# EAGLE design HS5035HD_Test_841 (EAGLE 7.4.0)
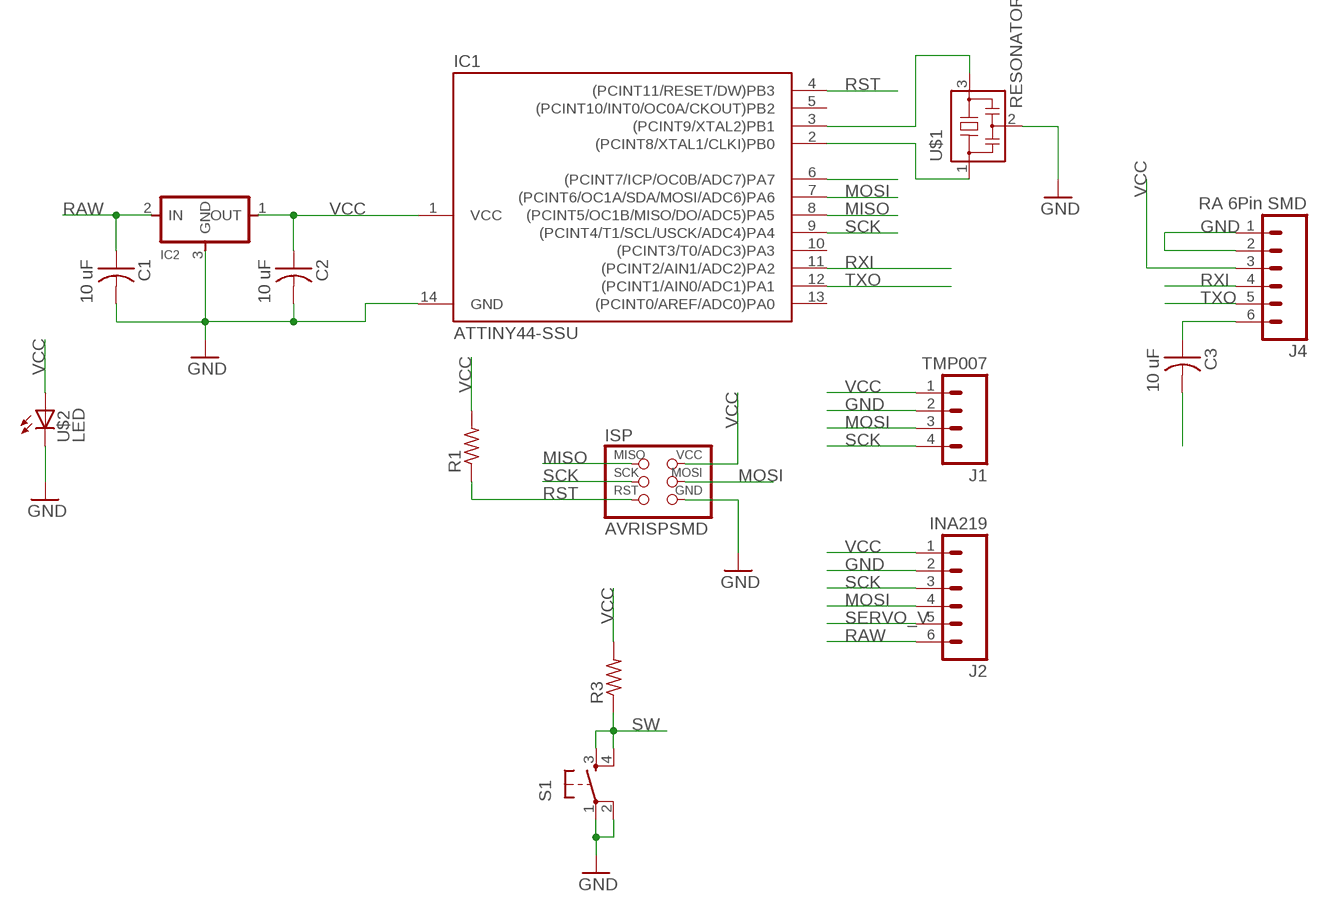
[diagram p0: schematic, sheet 1]

## Parts
C1  10 uF  CAP-US1206FAB  [C1206FAB]
C2  10 uF  CAP-US1206FAB  [C1206FAB]
C3  10 uF  CAP-US1206FAB  [C1206FAB]
IC1  ATTINY44-SSU  [SOIC14]
IC2  REGULATORSOT23  [SOT23]
ISP  AVRISPSMD  [2X03SMD]
J1  TMP007  M04SMD  [1X04-SMD]
J2  INA219  M06SMD  [1X06-SMD]
J4  RA 6Pin SMD  M06SMD  [1X06-SMD]
R1  RES-US1206FAB  [R1206FAB]
R3  RES-US1206FAB  [R1206FAB]
S1  6MM_SWITCH6MM_SWITCH  [6MM_SWITCH]
U$1  RESONATOR  [EFOBM]
U$2  LED  [LED1206]

## Nets
GND: C1.2 C2.2 IC1.14(GND) IC2.3(GND) ISP.6(GND) J1.2 J2.2 J4.1 J4.2 S1.1(P) S1.2(P1) U$1.2 U$2.2(C)
MISO: IC1.8((PCINT5/OC1B/MISO/DO/ADC5)PA5) ISP.1(MISO)
MOSI: IC1.7((PCINT6/OC1A/SDA/MOSI/ADC6)PA6) ISP.4(MOSI) J1.3 J2.4
N$2: IC1.3((PCINT9/XTAL2)PB1) U$1.3
N$3: IC1.2((PCINT8/XTAL1/CLKI)PB0) U$1.1
N$13: C3.1 J4.6
RAW: C1.1 IC2.2(IN) J2.6
RST: C3.2 IC1.4((PCINT11/RESET/DW)PB3) ISP.5(RST) R1.1
RXI: IC1.11((PCINT2/AIN1/ADC2)PA2) J4.4
SCK: IC1.9((PCINT4/T1/SCL/USCK/ADC4)PA4) ISP.3(SCK) J1.4 J2.3
SERVO_V: J2.5
SW: IC1.6((PCINT7/ICP/OC0B/ADC7)PA7) R3.1 S1.3(S) S1.4(S1)
TXO: IC1.12((PCINT1/AIN0/ADC1)PA1) J4.5
VCC: C2.1 IC1.1(VCC) IC2.1(OUT) ISP.2(VCC) J1.1 J2.1 J4.3 R1.2 R3.2 U$2.1(A)
Unconnected: IC1.5((PCINT10/INT0/OC0A/CKOUT)PB2) IC1.10((PCINT3/T0/ADC3)PA3) IC1.13((PCINT0/AREF/ADC0)PA0)

## Library data of the parts
C1-C3 = fab:CAP-US
IC1 = fab:ATTINY44
IC2 = fab:REGULATOR
ISP = fab:AVRISP
J1 = SparkFun-Connectors:M04: Header 4 Standard 4-pin 0.1" header. Use with straight break away headers (SKU : PRT-00116), right angle break away headers (PRT-00553), swiss pins (PRT-00743), machine pins (PRT-00117), and female headers (PRT-00115). Molex polarized connector foot print use with SKU : PRT-08231 with associated crimp pins and housings. 1MM SMD Version SKU: PRT-10208
J2 = SparkFun-Connectors:M06: Header 6 Standard 6-pin 0.1" header. Use with straight break away headers (SKU : PRT-00116), right angle break away headers (PRT-00553), swiss pins (PRT-00743), machine pins (PRT-00117), and female headers (PRT-00115). Molex polarized connector foot print use with SKU : PRT-08094 with associated crimp pins and housings. NOTES ON THE VARIANTS LOCK and LOCK_LONGPADS... This footprint was designed to help hold the alignment of a through-hole component (i.e. 6-pin header) while soldering it into place. You may notice that each hole has been shifted either up or down by 0.005 of an inch from it's more standard position (which is a perfectly straight line). This slight alteration caused the pins (the squares in the middle) to touch the edges of the holes. Because they are alternating, it causes a "brace" to hold the component in place. 0.005 has proven to be the perfect amount of "off-center" position when using our standard breakaway headers. Although looks a little odd when you look at the bare footprint, once you have a header in there, the alteration is very hard to notice. Also,if you push a header all the way into place, it is covered up entirely on the bottom side. This idea of altering the position of holes to aid alignment will be further integrated into the Sparkfun Library for other footprints. It can help hold any component with 3 or more connection pins.; PROD_ID: CONN-08971; VALUE: RA 6Pin SMD
J4 = SparkFun-Connectors:M06: Header 6 Standard 6-pin 0.1" header. Use with straight break away headers (SKU : PRT-00116), right angle break away headers (PRT-00553), swiss pins (PRT-00743), machine pins (PRT-00117), and female headers (PRT-00115). Molex polarized connector foot print use with SKU : PRT-08094 with associated crimp pins and housings. NOTES ON THE VARIANTS LOCK and LOCK_LONGPADS... This footprint was designed to help hold the alignment of a through-hole component (i.e. 6-pin header) while soldering it into place. You may notice that each hole has been shifted either up or down by 0.005 of an inch from it's more standard position (which is a perfectly straight line). This slight alteration caused the pins (the squares in the middle) to touch the edges of the holes. Because they are alternating, it causes a "brace" to hold the component in place. 0.005 has proven to be the perfect amount of "off-center" position when using our standard breakaway headers. Although looks a little odd when you look at the bare footprint, once you have a header in there, the alteration is very hard to notice. Also,if you push a header all the way into place, it is covered up entirely on the bottom side. This idea of altering the position of holes to aid alignment will be further integrated into the Sparkfun Library for other footprints. It can help hold any component with 3 or more connection pins.; PROD_ID: CONN-08971
R1 R3 = fab:RES-US: Resistor (US Symbol) Variants with postfix FAB are widened to allow the routing of internal traces
S1 = fab:6MM_SWITCH: OMRON SWITCH
U$1 = fab:RESONATOR
U$2 = fab:LED: LED

## Board
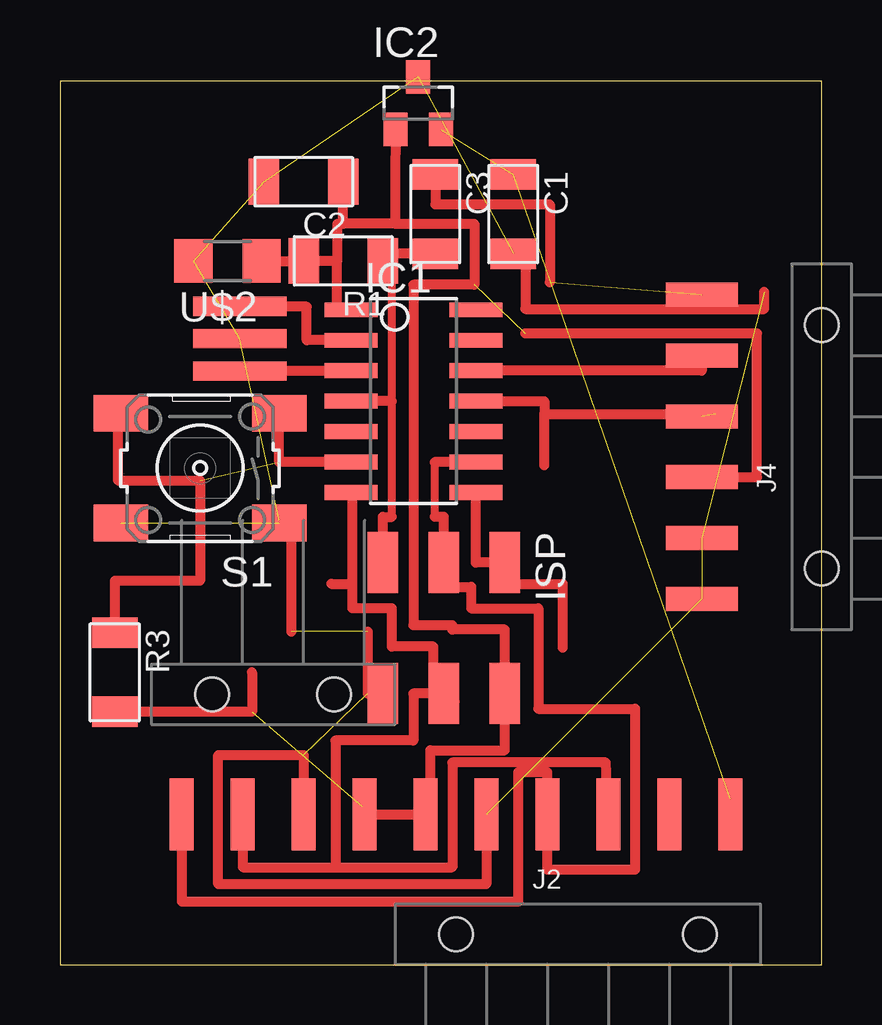
[diagram p1: board, top side]

Size 31.75 x 36.83 mm. Coordinates in mm from the lower left corner, seen from the top.
Outline: 0,0 31.75,0 31.75,36.83 0,36.83 0,0
Copper layers (1*16): Top 0.035mm / dielectric 1.5mm / Bottom 0.035mm
Design rules "default *": minimum track width 10mil, minimum drill 24mil, track to track 16mil, track to pad 16mil, pad to pad 16mil, via to via 16mil, smd to smd 4mil, copper to edge 16mil, drill to drill 8mil, minimum pad ring 10mil, minimum via ring 8mil, stop-mask expansion 4mil, vias tented up to drill 0mil, thermal gap 0mil

### Footprints (pad centres in the part's own frame; a part is rotated, then mirrored left to right if it is on the bottom)
C1206FAB = smd 1.27 x 1.905: 1 -1.651,0; 2 1.651,0
SOIC14 = smd 0.61 x 2.21: 1 -3.81,-2.603; 2 -2.54,-2.603; 3 -1.27,-2.603; 4 0,-2.603; 5 1.27,-2.603; 6 2.54,-2.603; 7 3.81,-2.603; 8 3.81,2.603; 9 2.54,2.603; 10 1.27,2.603; 11 0,2.603; 12 -1.27,2.603; 13 -2.54,2.603; 14 -3.81,2.603
SOT23 = smd 1 x 1.4: 1 -0.95,-1.1; 2 0.95,-1.1; 3 0,1.1
2X03SMD = smd 2.54 x 1.27: 1 -2.54,2.54; 2 2.92,2.54; 3 -2.54,0; 4 2.92,0; 5 -2.54,-2.54; 6 2.92,-2.54
1X04-SMD = smd 1 x 3: 1 -3.81,5; 2 -1.27,5; 3 1.27,5; 4 3.81,5 | hole 1.4: -2.54,0; 2.54,0
1X06-SMD = smd 1 x 3: 1 -6.35,5; 2 -3.81,5; 3 -1.27,5; 4 1.27,5; 5 3.81,5; 6 6.35,5 | hole 1.4: -5.08,0; 5.08,0
R1206FAB = smd 1.27 x 1.905: 1 -1.651,0; 2 1.651,0
6MM_SWITCH = smd 2.286 x 1.524: 1 -3.302,2.286; 2 3.302,2.286; 3 -3.302,-2.286; 4 3.302,-2.286
EFOBM = smd 0.8 x 3.9: 1 -1.35,0; 2 0,0; 3 1.35,0
LED1206 = smd 1.6 x 1.803: 1 -1.422,0; 2 1.422,0

### Placement (x,y rotation side)
C1  18.9,31.29 270 top
C2  10.16,32.64 180 top
C3  15.65,31.29 270 top
IC1  14.73,23.5 270 top
IC2  14.94,35.92 0 top
ISP  16,14.22 270 top
J1  8.89,11.28 180 top
J2  21.59,1.27 0 top
J4  31.75,21.59 90 top
R1  11.81,29.34 180 top
R3  2.29,12.19 270 top
S1  5.84,20.7 180 top
U$1  7.49,26.1 270 top
U$2  6.99,29.34 180 top

### Tracks (layer width: path | path; a pad name or v marks a point on that pad's centre or on a via)
GND  (11 unrouted)
  Top 0.406: 9.65,13.89 9.65,18.54 9.14,18.54 S1.1 | 12.83,13.89 12.83,11.3 ISP.6 | J2.2 17.78,3.35 6.6,3.35 6.6,8.74 10.16,8.74 J1.2 | C1.2 19.41,29.64 19.41,27.33 29.36,27.33 29.36,28.04
  Top 1.016: ISP.6
MISO
  Top 0.406: IC1.8 17.34,16.76 ISP.1 18.54,15.88 20.95,15.88 20.95,13.21
MOSI
  Top 0.406: ISP.4 16,12.37 15.57,12.37 15.57,13.26 13.84,13.26 13.84,14.86 12.19,14.86 12.19,15.88 | 12.19,15.88 12.19,19.68 IC1.7 | 11.3,15.88 12.19,15.88 | ISP.4 14.73,11.3 14.73,9.35 11.48,9.35 11.48,4.06 | J2.4 22.76,8.43 16.36,8.43 16.36,4.06 11.48,4.06 | 16.46,10.97 16,10.97 ISP.4 | J1.3 7.62,4.06 11.48,4.06
N$2
  Top 0.406: IC1.3 12.13,24.75 U$1.3
N$3
  Top 0.406: IC1.2 10.29,26.04 10.29,27.43 6.6,27.43 6.6,27.3 7.62,27.3 U$1.1
N$13  (1 unrouted)
  Top 0.406: C3.1 15.65,31.7 20.42,31.7 20.42,28.45
RAW  (2 unrouted)
  Top 0.406: J2.6 27.94,6.91 28.14,6.91
RST
  Top 0.33: 13.84,18.67 13.84,23.5 13.84,29.08 R1.1
  Top 0.406: ISP.5 13.46,18.67 13.84,18.67 | 13.84,23.5 IC1.4 | C3.2 13.46,29.64 R1.1
RXI  (1 unrouted)
  Top 0.406: IC1.11 20.19,23.5 20.19,22.96 | 20.19,20.83 20.19,22.96 | 20.19,22.96 27.33,22.96
SCK
  Top 0.33: 15.62,20.95 15.62,18.67
  Top 0.406: IC1.9 15.62,20.95 | 15.62,18.67 16,18.67 ISP.3 16,15.75 17.14,15.75 17.14,14.86 19.94,14.86 19.94,10.67 23.98,10.67 23.98,3.96 20.32,3.96 J2.3 20.32,8.03 19.1,8.03 19.1,2.64 5.08,2.64 J1.4
SW  (1 unrouted)
  Top 0.406: IC1.6 9.14,20.95 S1.3 | R3.1 2.29,16 5.84,16 5.84,20.19 2.41,20.19 2.41,22.99 S1.4
TXO
  Top 0.406: J4.5 26.75,24.77 IC1.12
VCC  (2 unrouted)
  Top 0.406: IC1.1 11.56,27.3 11.56,29.34 | 11.56,29.34 R1.2 U$2.1 | 13.97,30.89 11.81,30.89 | 11.56,29.34 11.56,30.89 11.81,30.89 | 8,12.19 8,10.54 R3.2 | 11.81,30.89 C2.1 | IC2.1 13.97,32.68 13.97,30.89 | J1.1 12.7,6.6 12.6,6.6 12.6,6.27 J2.1 15.44,6.27 15.44,8.94 18.54,8.94 ISP.2 18.54,13.97 16.36,13.97 16.36,14.15 14.73,14.15 14.73,28.35 17.27,28.35 17.27,30.89 13.97,30.89 | J4.3 29.06,20.32 29.06,26.31 19.41,26.31